# Altium schematic sheet Sheet1.SchDoc
size A4
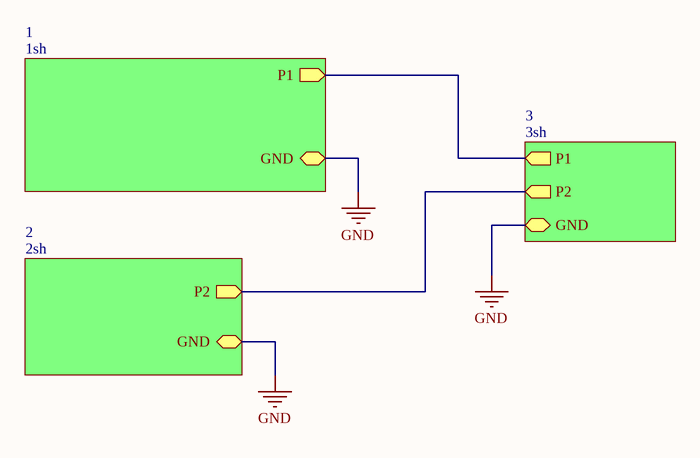
[diagram p0: Sheet1.SchDoc]

## Sub-sheets
1 = 1sh: P1 (out), GND
2 = 2sh: P2 (out), GND
3 = 3sh: P1 (out), P2 (out), GND

## Nets
GND: sheet 1/GND, sheet 2/GND, sheet 3/GND
(unnamed): sheet 1/P1, sheet 3/P1
(unnamed): sheet 2/P2, sheet 3/P2